# EAGLE schematic PocketBeagle (EAGLE 9.6.1)
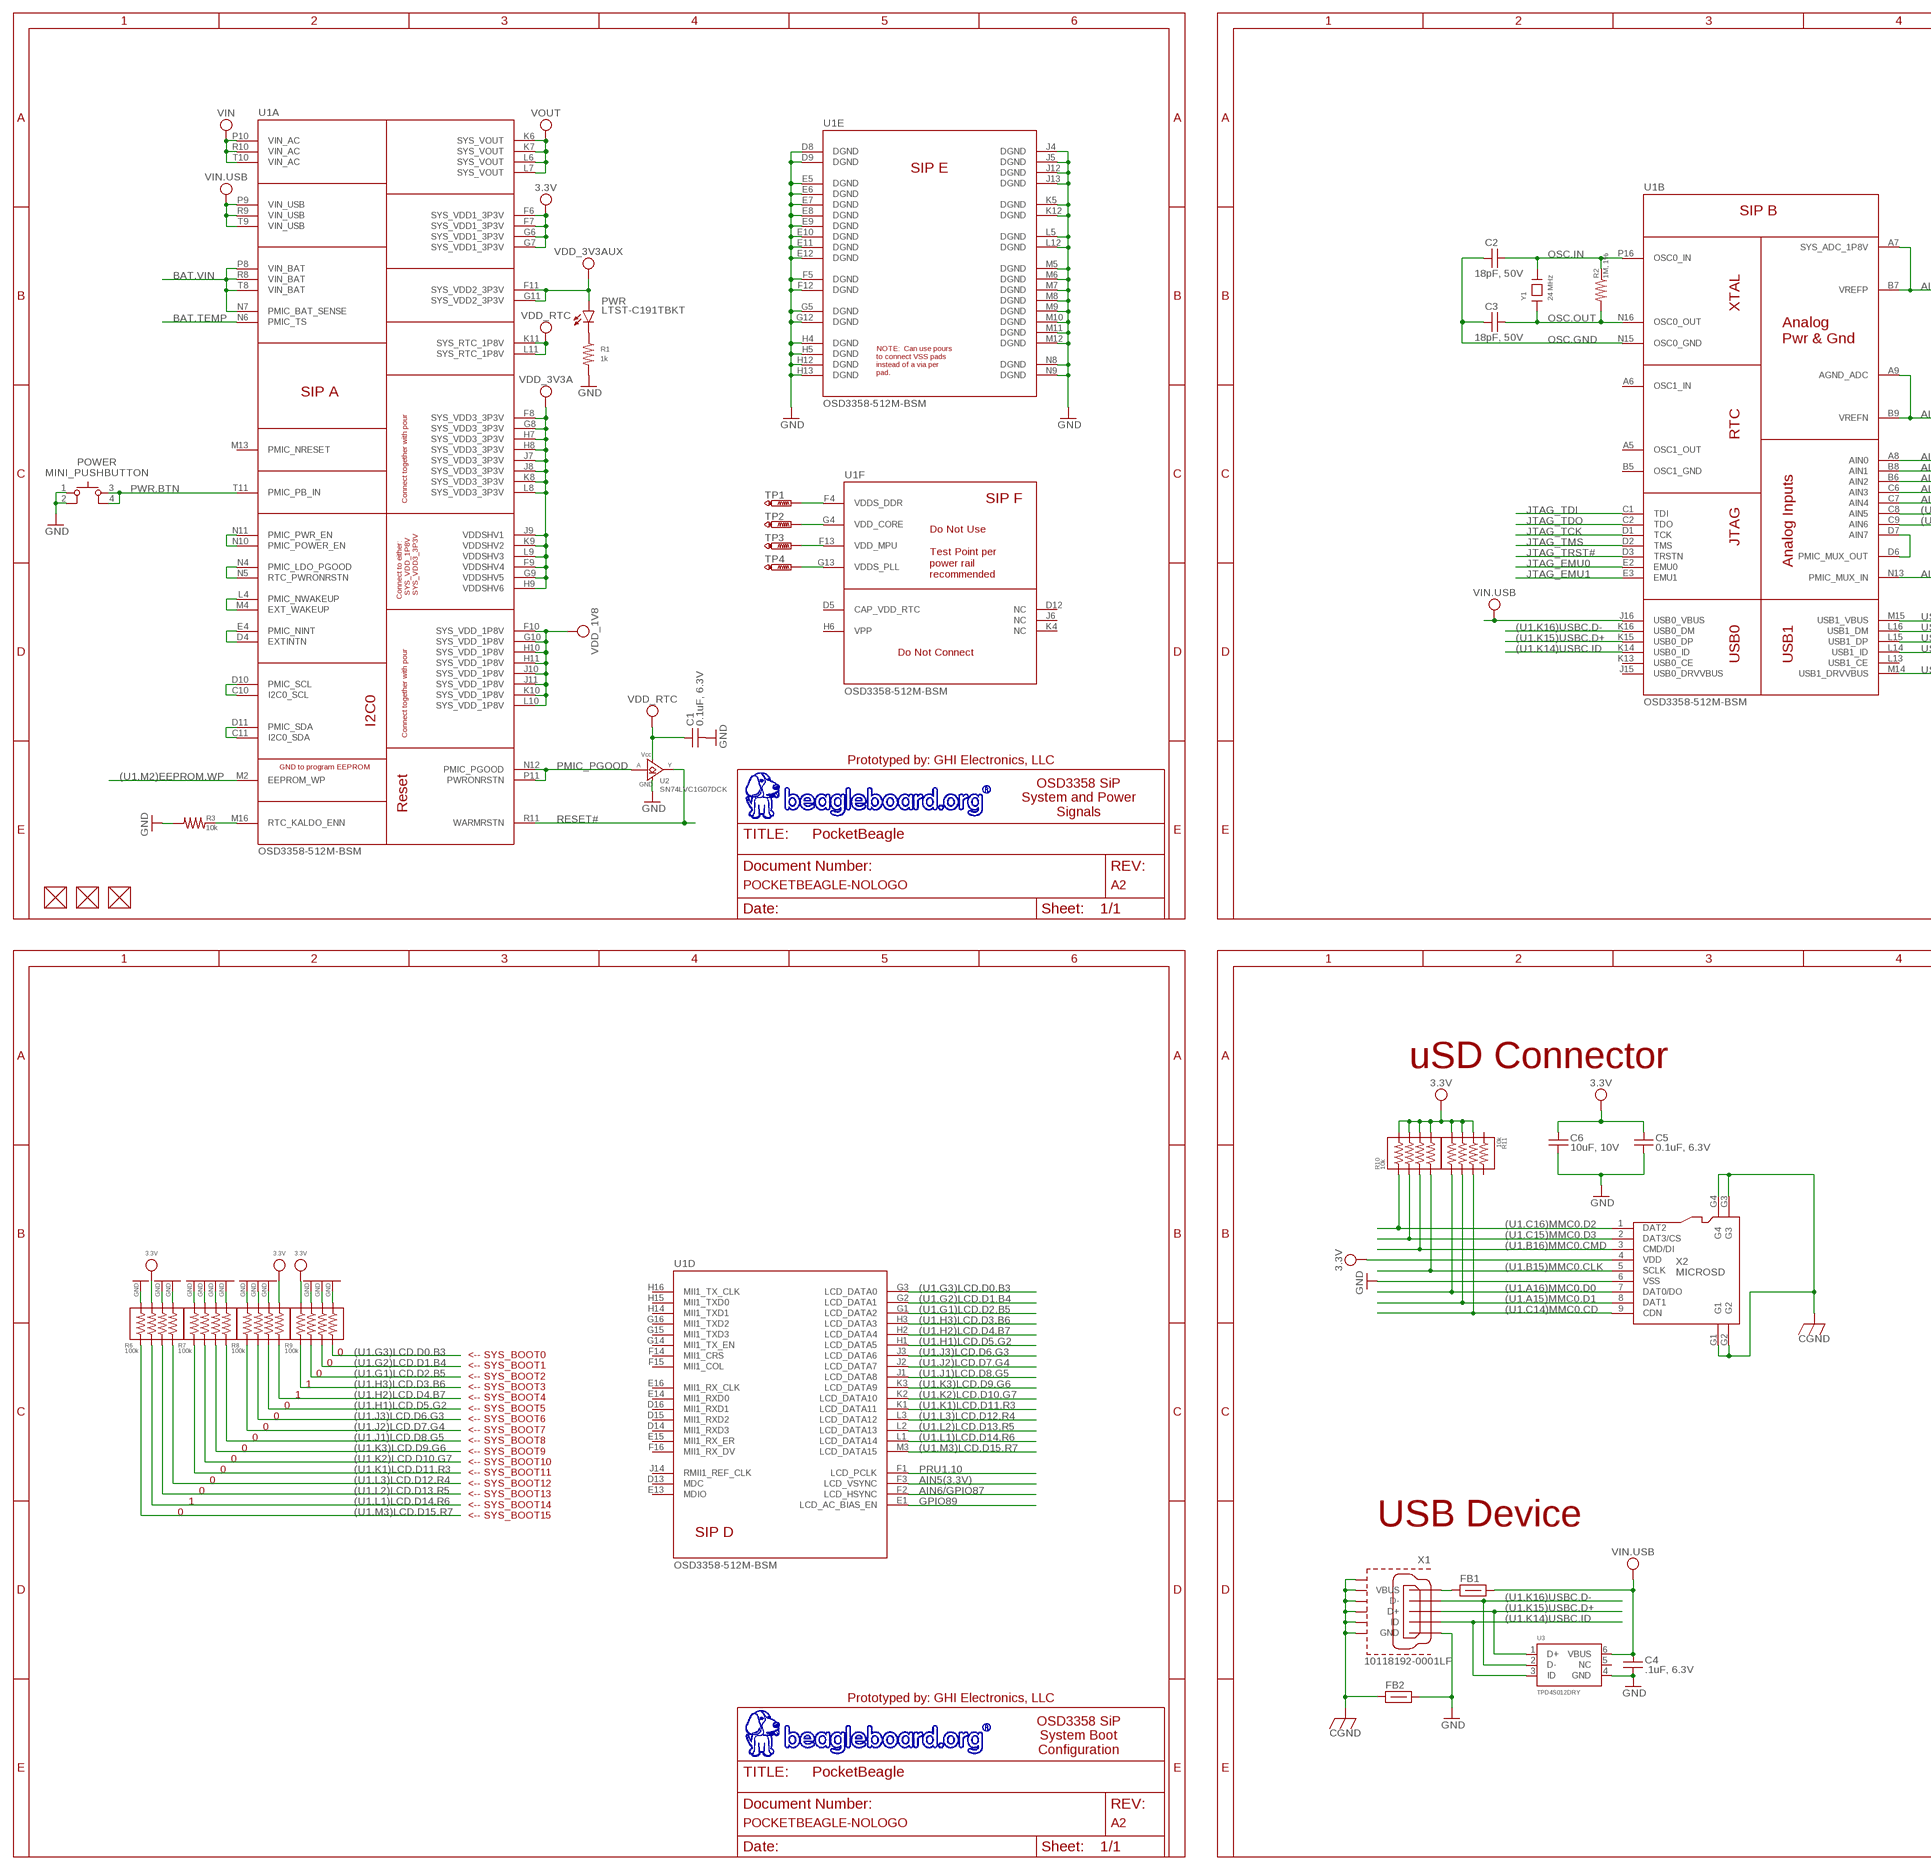
[diagram p0: schematic, sheet 1, part 1 of 2]
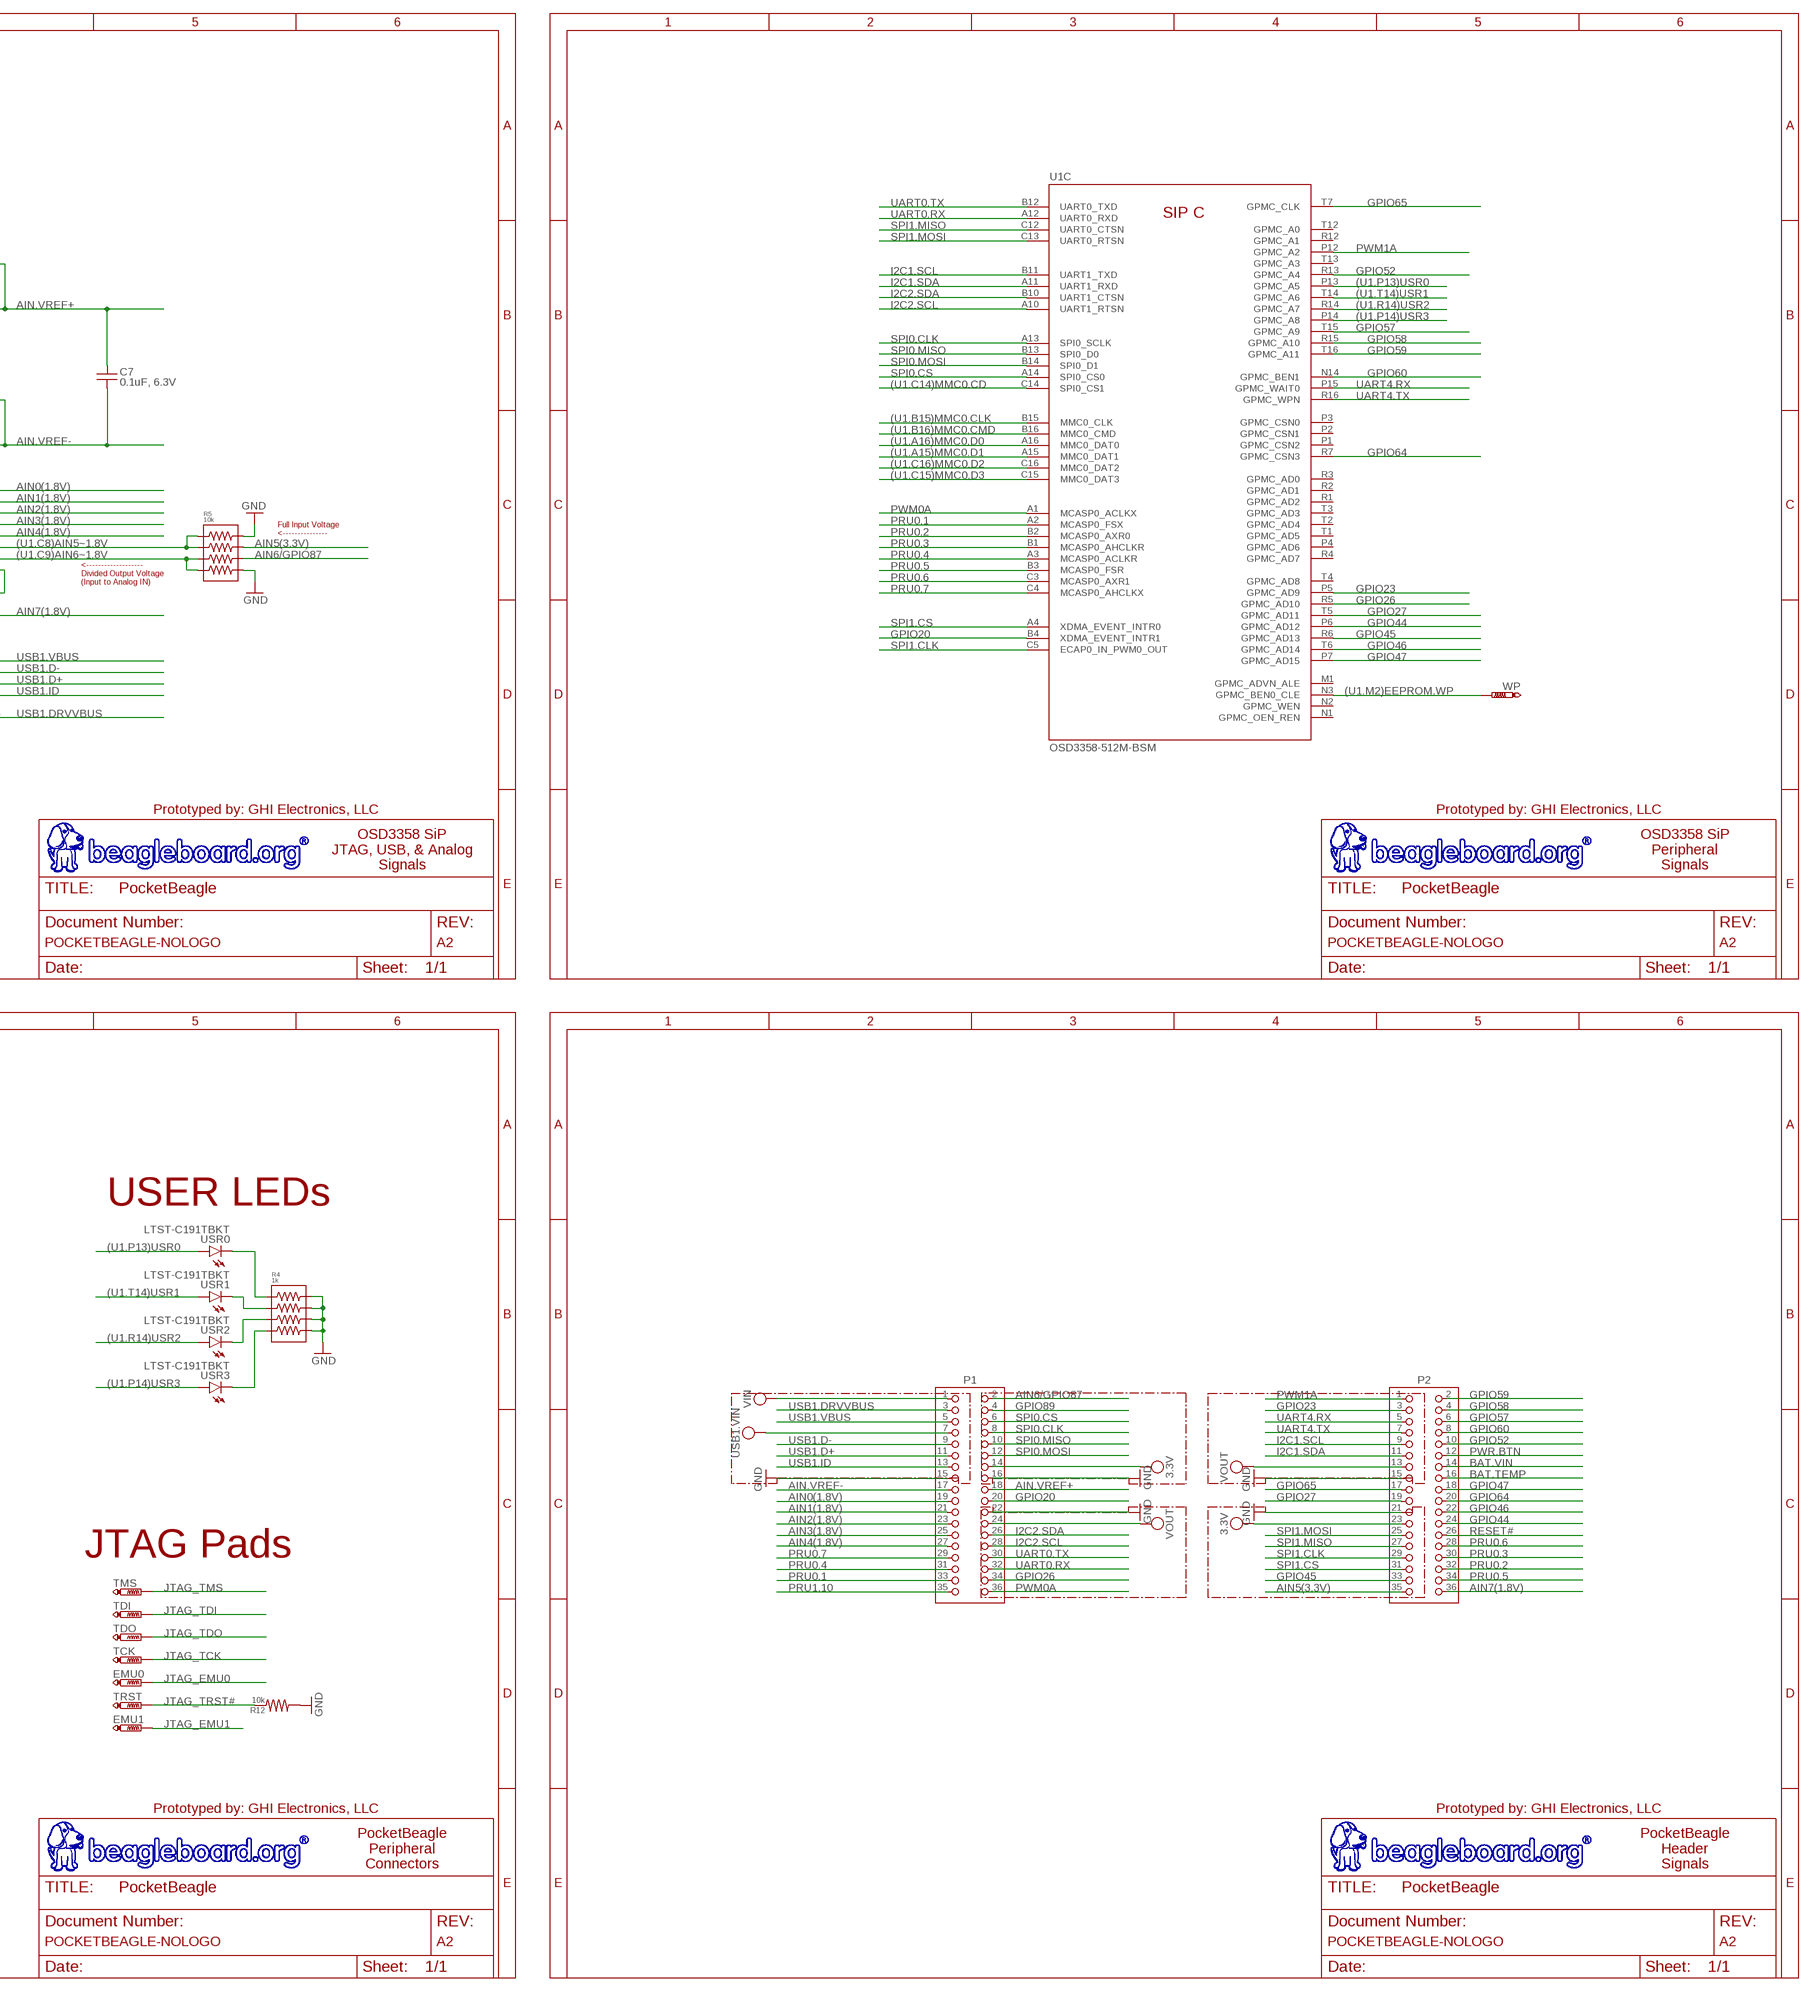
[diagram p1: schematic, sheet 1, part 2 of 2]

## Parts
C1  0.1uF, 6.3V  CAPACITOR-(INCH)-0402  [0402]
C2  18pF, 50V  CAPACITOR-(INCH)-0402  [0402]
C3  18pF, 50V  CAPACITOR-(INCH)-0402  [0402]
C4  .1uF, 6.3V  CAPACITOR-(INCH)-0402  [0402]
C5  0.1uF, 6.3V  CAPACITOR-(INCH)-0402  [0402]
C6  10uF, 10V  CAPACITOR-(INCH)-0603  [0603]
C7  0.1uF, 6.3V  CAPACITOR-(INCH)-0402  [0402]
EMU0  PTR1B1,27  [B1,27]
EMU1  PTR1B1,27  [B1,27]
FB1  FB-(INCH)-0603  [0603]
FB2  FB-(INCH)-0603  [0603]
FUD1  FIDUCIAL  [FIDUCIAL_40MIL]
FUD2  FIDUCIAL  [FIDUCIAL_40MIL]
FUD3  FIDUCIAL  [FIDUCIAL_40MIL]
P1  2X18-(INCH)-0.1-TH-(35MIL-DIA)-W/O-SILK  [TH-2X18-(35MIL-DIA)-W/O-SILK]
P2  2X18-(INCH)-0.1-TH-(35MIL-DIA)-W/O-SILK  [TH-2X18-(35MIL-DIA)-W/O-SILK]
POWER  MINI_PUSHBUTTON  [MINI_PUSHBUTTON]
PWR  LTST-C191TBKT  LED-(INCH)-0603  [0603-LED]
R1  1k  RESISTOR-(INCH)-0402  [0402]
R2  1M, 1%  RESISTOR-(INCH)-0402  [0402]
R3  10k  RESISTOR-(INCH)-0402  [0402]
R4  1k  RESISTOR.NETWORK-(4)  [RN0804]
R5  10k  RESISTOR.NETWORK-(4)  [RN0804]
R6  100k  RESISTOR.NETWORK-(4)  [RN0804]
R7  100k  RESISTOR.NETWORK-(4)  [RN0804]
R8  100k  RESISTOR.NETWORK-(4)  [RN0804]
R9  100k  RESISTOR.NETWORK-(4)  [RN0804]
R10  10k  RESISTOR.NETWORK-(4)  [RN0804]
R11  10k  RESISTOR.NETWORK-(4)  [RN0804]
R12  10k  RESISTOR-(INCH)-0402  [0402]
TCK  PTR1B1,27  [B1,27]
TDI  PTR1B1,27  [B1,27]
TDO  PTR1B1,27  [B1,27]
TMS  PTR1B1,27  [B1,27]
TP1  PTR1B1,27  [B1,27]
TP2  PTR1B1,27  [B1,27]
TP3  PTR1B1,27  [B1,27]
TP4  PTR1B1,27  [B1,27]
TRST  PTR1B1,27  [B1,27]
U1  OSD3358-512M-BSM  [OSD335X-BGA-256]
U2  SN74LVC1G07DCK  [SC70(TI-DCK)]
U3  TPD4S012DRY  TPD4S012DRYR  [SON-6(TI)-DRY]
USR0  LTST-C191TBKT  LED-(INCH)-0603  [0603-LED]
USR1  LTST-C191TBKT  LED-(INCH)-0603  [0603-LED]
USR2  LTST-C191TBKT  LED-(INCH)-0603  [0603-LED]
USR3  LTST-C191TBKT  LED-(INCH)-0603  [0603-LED]
WP  PTR1B1,27  [B1,27]
X1  10118192-0001LF  [10118192-0001LF(MICRO-USB-B-AMPHENOL-FCI)]
X2  MICROSD  [MICROSD]
Y1  24 MHz  CRYSTAL_5X3.2MM  [CRYSTAL_5X3.2MM]

## Nets
3.3V: C5.1 C6.1 P1.14 P2.23 R6.7 R8.5 R9.4 R10.5 R10.6 R10.7 R10.8 R11.2 R11.3 R11.4 U1.F6(A:SYS_VDD1_3P3V) U1.F7(A:SYS_VDD1_3P3V) U1.G6(A:SYS_VDD1_3P3V) U1.G7(A:SYS_VDD1_3P3V) X2.4(VDD)
(U1.A15)MMC0.D1: R11.6 U1.A15(C:MMC0_DAT1) X2.8(DAT1)
(U1.A16)MMC0.D0: R11.5 U1.A16(C:MMC0_DAT0) X2.7(DAT0/DO)
(U1.B15)MMC0.CLK: R10.4 U1.B15(C:MMC0_CLK) X2.5(SCLK)
(U1.B16)MMC0.CMD: R10.3 U1.B16(C:MMC0_CMD) X2.3(CMD/DI)
(U1.C8)AIN5~1.8V: R5.1 R5.2 U1.C8(B:AIN5)
(U1.C9)AIN6~1.8V: R5.3 R5.4 U1.C9(B:AIN6)
(U1.C14)MMC0.CD: R11.7 U1.C14(C:SPI0_CS1) X2.9(CDN)
(U1.C15)MMC0.D3: R10.2 U1.C15(C:MMC0_DAT3) X2.2(DAT3/CS)
(U1.C16)MMC0.D2: R10.1 U1.C16(C:MMC0_DAT2) X2.1(DAT2)
(U1.G1)LCD.D2.B5: R9.6 U1.G1(D:LCD_DATA2)
(U1.G2)LCD.D1.B4: R9.7 U1.G2(D:LCD_DATA1)
(U1.G3)LCD.D0.B3: R9.8 U1.G3(D:LCD_DATA0)
(U1.H1)LCD.D5.G2: R8.3 U1.H1(D:LCD_DATA5)
(U1.H2)LCD.D4.B7: R8.4 U1.H2(D:LCD_DATA4)
(U1.H3)LCD.D3.B6: R9.5 U1.H3(D:LCD_DATA3)
(U1.J1)LCD.D8.G5: R7.4 U1.J1(D:LCD_DATA8)
(U1.J2)LCD.D7.G4: R8.1 U1.J2(D:LCD_DATA7)
(U1.J3)LCD.D6.G3: R8.2 U1.J3(D:LCD_DATA6)
(U1.K1)LCD.D11.R3: R7.1 U1.K1(D:LCD_DATA11)
(U1.K2)LCD.D10.G7: R7.2 U1.K2(D:LCD_DATA10)
(U1.K3)LCD.D9.G6: R7.3 U1.K3(D:LCD_DATA9)
(U1.K14)USBC.ID: U1.K14(B:USB0_ID) U3.3(ID) X1.ID
(U1.K15)USBC.D+: U1.K15(B:USB0_DP) U3.1(D+) X1.D+
(U1.K16)USBC.D-: U1.K16(B:USB0_DM) U3.2(D-) X1.D-
(U1.L1)LCD.D14.R6: R6.2 U1.L1(D:LCD_DATA14)
(U1.L2)LCD.D13.R5: R6.3 U1.L2(D:LCD_DATA13)
(U1.L3)LCD.D12.R4: R6.4 U1.L3(D:LCD_DATA12)
(U1.M2)EEPROM.WP: U1.M2(A:EEPROM_WP) U1.N3(C:GPMC_BEN0_CLE) WP.TP
(U1.M3)LCD.D15.R7: R6.1 U1.M3(D:LCD_DATA15)
(U1.P13)USR0: U1.P13(C:GPMC_A5) USR0.A
(U1.P14)USR3: U1.P14(C:GPMC_A8) USR3.A
(U1.R14)USR2: U1.R14(C:GPMC_A7) USR2.A
(U1.T14)USR1: U1.T14(C:GPMC_A6) USR1.A
AIN0(1.8V): P1.19 U1.A8(B:AIN0)
AIN1(1.8V): P1.21 U1.B8(B:AIN1)
AIN2(1.8V): P1.23 U1.B6(B:AIN2)
AIN3(1.8V): P1.25 U1.C6(B:AIN3)
AIN4(1.8V): P1.27 U1.C7(B:AIN4)
AIN5(3.3V): P2.35 R5.7 U1.F3(D:LCD_VSYNC)
AIN6/GPIO87: P1.2 R5.6 U1.F2(D:LCD_HSYNC)
AIN7(1.8V): P2.36 U1.N13(B:PMIC_MUX_IN)
AIN.VREF+: C7.1 P1.18 U1.A7(B:SYS_ADC_1P8V) U1.B7(B:VREFP)
AIN.VREF-: C7.2 P1.17 U1.A9(B:AGND_ADC) U1.B9(B:VREFN)
BAT.TEMP: P2.16 U1.N6(A:PMIC_TS)
BAT.VIN: P2.14 U1.N7(A:PMIC_BAT_SENSE) U1.P8(A:VIN_BAT) U1.R8(A:VIN_BAT) U1.T8(A:VIN_BAT)
CGND: FB2.1 X1.CGND1(SGND1) X1.CGND2(SGND2) X1.CGND3(SGND3) X1.CGND4(SGND4) X1.CGND5(SGND5) X1.CGND6(SGND6) X2.G1 X2.G2 X2.G3 X2.G4
GND [power]: C1.2 C4.2 C5.2 C6.2 FB2.2 P1.15 P1.16 P1.22 P2.15 P2.21 POWER.1 POWER.2 R1.1 R3.1 R4.5 R4.6 R4.7 R4.8 R5.5 R5.8 R6.5 R6.6 R6.8 R7.5 R7.6 R7.7 R7.8 R8.6 R8.7 R8.8 R9.1 R9.2 R9.3 R12.1 U1.D8(E:DGND) U1.D9(E:DGND) U1.E5(E:DGND) U1.E6(E:DGND) U1.E7(E:DGND) U1.E8(E:DGND) U1.E9(E:DGND) U1.E10(E:DGND) U1.E11(E:DGND) U1.E12(E:DGND) U1.F5(E:DGND) U1.F12(E:DGND) U1.G5(E:DGND) U1.G12(E:DGND) U1.H4(E:DGND) U1.H5(E:DGND) U1.H12(E:DGND) U1.H13(E:DGND) U1.J4(E:DGND) U1.J5(E:DGND) U1.J12(E:DGND) U1.J13(E:DGND) U1.K5(E:DGND) U1.K12(E:DGND) U1.L5(E:DGND) U1.L12(E:DGND) U1.M5(E:DGND) U1.M6(E:DGND) U1.M7(E:DGND) U1.M8(E:DGND) U1.M9(E:DGND) U1.M10(E:DGND) U1.M11(E:DGND) U1.M12(E:DGND) U1.N8(E:DGND) U1.N9(E:DGND) U2.3(GND) U3.4(GND) X1.GND X2.6(VSS)
GPIO20: P1.20 U1.B4(C:XDMA_EVENT_INTR1)
GPIO23: P2.3 U1.P5(C:GPMC_AD9)
GPIO26: P1.34 U1.R5(C:GPMC_AD10)
GPIO27: P2.19 U1.T5(C:GPMC_AD11)
GPIO44: P2.24 U1.P6(C:GPMC_AD12)
GPIO45: P2.33 U1.R6(C:GPMC_AD13)
GPIO46: P2.22 U1.T6(C:GPMC_AD14)
GPIO47: P2.18 U1.P7(C:GPMC_AD15)
GPIO52: P2.10 U1.R13(C:GPMC_A4)
GPIO57: P2.6 U1.T15(C:GPMC_A9)
GPIO58: P2.4 U1.R15(C:GPMC_A10)
GPIO59: P2.2 U1.T16(C:GPMC_A11)
GPIO60: P2.8 U1.N14(C:GPMC_BEN1)
GPIO64: P2.20 U1.R7(C:GPMC_CSN3)
GPIO65: P2.17 U1.T7(C:GPMC_CLK)
GPIO89: P1.4 U1.E1(D:LCD_AC_BIAS_EN)
I2C1.SCL: P2.9 U1.B11(C:UART1_TXD)
I2C1.SDA: P2.11 U1.A11(C:UART1_RXD)
I2C2.SCL: P1.28 U1.A10(C:UART1_RTSN)
I2C2.SDA: P1.26 U1.B10(C:UART1_CTSN)
JTAG_EMU0: EMU0.TP U1.E2(B:EMU0)
JTAG_EMU1: EMU1.TP U1.E3(B:EMU1)
JTAG_TCK: TCK.TP U1.D1(B:TCK)
JTAG_TDI: TDI.TP U1.C1(B:TDI)
JTAG_TDO: TDO.TP U1.C2(B:TDO)
JTAG_TMS: TMS.TP U1.D2(B:TMS)
JTAG_TRST#: R12.2 TRST.TP U1.D3(B:TRSTN)
N$1: R4.3 USR2.K
N$2: R4.4 USR3.K
N$4: PWR.K R1.2
N$5: R4.2 USR1.K
N$6: R4.1 USR0.K
N$7: TP1.TP U1.F4(F:VDDS_DDR)
N$9: TP2.TP U1.G4(F:VDD_CORE)
N$10: TP3.TP U1.F13(F:VDD_MPU)
N$11: TP4.TP U1.G13(F:VDDS_PLL)
N$12: U1.D6(B:PMIC_MUX_OUT) U1.D7(B:AIN7)
N$22: R3.2 U1.M16(A:RTC_KALDO_ENN)
N$24: U1.N4(A:PMIC_LDO_PGOOD) U1.N5(A:RTC_PWRONRSTN)
N$25: U1.L4(A:PMIC_NWAKEUP) U1.M4(A:EXT_WAKEUP)
N$26: U1.D4(A:EXTINTN) U1.E4(A:PMIC_NINT)
N$27: U1.N10(A:PMIC_POWER_EN) U1.N11(A:PMIC_PWR_EN)
N$31: U1.C11(A:I2C0_SDA) U1.D11(A:PMIC_SDA)
N$32: U1.C10(A:I2C0_SCL) U1.D10(A:PMIC_SCL)
OSC.GND: C2.1 C3.1 U1.N15(B:OSC0_GND)
OSC.IN: C2.2 R2.2 U1.P16(B:OSC0_IN) Y1.2
OSC.OUT: C3.2 R2.1 U1.N16(B:OSC0_OUT) Y1.1
PMIC_PGOOD: U1.N12(A:PMIC_PGOOD) U1.P11(A:PWRONRSTN) U2.2(A)
PRU0.1: P1.33 U1.A2(C:MCASP0_FSX)
PRU0.2: P2.32 U1.B2(C:MCASP0_AXR0)
PRU0.3: P2.30 U1.B1(C:MCASP0_AHCLKR)
PRU0.4: P1.31 U1.A3(C:MCASP0_ACLKR)
PRU0.5: P2.34 U1.B3(C:MCASP0_FSR)
PRU0.6: P2.28 U1.C3(C:MCASP0_AXR1)
PRU0.7: P1.29 U1.C4(C:MCASP0_AHCLKX)
PRU1.10: P1.35 U1.F1(D:LCD_PCLK)
PWM0A: P1.36 U1.A1(C:MCASP0_ACLKX)
PWM1A: P2.1 U1.P12(C:GPMC_A2)
PWR.BTN: P2.12 POWER.3 POWER.4 U1.T11(A:PMIC_PB_IN)
RESET#: P2.26 U1.R11(A:WARMRSTN) U2.4(Y)
SPI0.CLK: P1.8 U1.A13(C:SPI0_SCLK)
SPI0.CS: P1.6 U1.A14(C:SPI0_CS0)
SPI0.MISO: P1.10 U1.B13(C:SPI0_D0)
SPI0.MOSI: P1.12 U1.B14(C:SPI0_D1)
SPI1.CLK: P2.29 U1.C5(C:ECAP0_IN_PWM0_OUT)
SPI1.CS: P2.31 U1.A4(C:XDMA_EVENT_INTR0)
SPI1.MISO: P2.27 U1.C12(C:UART0_CTSN)
SPI1.MOSI: P2.25 U1.C13(C:UART0_RTSN)
UART0.RX: P1.32 U1.A12(C:UART0_RXD)
UART0.TX: P1.30 U1.B12(C:UART0_TXD)
UART4.RX: P2.5 U1.P15(C:GPMC_WAIT0)
UART4.TX: P2.7 U1.R16(C:GPMC_WPN)
USB1.D+: P1.11 U1.L15(B:USB1_DP)
USB1.D-: P1.9 U1.L16(B:USB1_DM)
USB1.DRVVBUS: P1.3 U1.M14(B:USB1_DRVVBUS)
USB1.ID: P1.13 U1.L14(B:USB1_ID)
USB1.VBUS: P1.5 U1.M15(B:USB1_VBUS)
VBUS.RAW: FB1.1 X1.VBUS
VDD_1V8: U1.F10(A:SYS_VDD_1P8V) U1.G10(A:SYS_VDD_1P8V) U1.H10(A:SYS_VDD_1P8V) U1.H11(A:SYS_VDD_1P8V) U1.J10(A:SYS_VDD_1P8V) U1.J11(A:SYS_VDD_1P8V) U1.K10(A:SYS_VDD_1P8V) U1.L10(A:SYS_VDD_1P8V)
VDD_3V3A: U1.F8(A:SYS_VDD3_3P3V) U1.F9(A:VDDSHV4) U1.G8(A:SYS_VDD3_3P3V) U1.G9(A:VDDSHV5) U1.H7(A:SYS_VDD3_3P3V) U1.H8(A:SYS_VDD3_3P3V) U1.H9(A:VDDSHV6) U1.J7(A:SYS_VDD3_3P3V) U1.J8(A:SYS_VDD3_3P3V) U1.J9(A:VDDSHV1) U1.K8(A:SYS_VDD3_3P3V) U1.K9(A:VDDSHV2) U1.L8(A:SYS_VDD3_3P3V) U1.L9(A:VDDSHV3)
VDD_3V3AUX: PWR.A U1.F11(A:SYS_VDD2_3P3V) U1.G11(A:SYS_VDD2_3P3V)
VDD_RTC: C1.1 U1.K11(A:SYS_RTC_1P8V) U1.L11(A:SYS_RTC_1P8V) U2.5(VCC)
VIN: P1.1 U1.P10(A:VIN_AC) U1.R10(A:VIN_AC) U1.T10(A:VIN_AC)
VIN.USB: C4.1 FB1.2 P1.7 U1.J16(B:USB0_VBUS) U1.P9(A:VIN_USB) U1.R9(A:VIN_USB) U1.T9(A:VIN_USB) U3.6(VBUS) ; supply symbol labelled USB1.VIN
VOUT: P1.24 P2.13 U1.K6(A:SYS_VOUT) U1.K7(A:SYS_VOUT) U1.L6(A:SYS_VOUT) U1.L7(A:SYS_VOUT)
Unconnected: FUD1.P$1 FUD2.P$1 FUD3.P$1 R11.1 R11.8 U1.A5(B:OSC1_OUT) U1.A6(B:OSC1_IN) U1.B5(B:OSC1_GND) U1.D5(F:CAP_VDD_RTC) U1.D12(F:NC) U1.D13(D:MDC) U1.D14(D:MII1_RXD3) U1.D15(D:MII1_RXD2) U1.D16(D:MII1_RXD1) U1.E13(D:MDIO) U1.E14(D:MII1_RXD0) U1.E15(D:MII1_RX_ER) U1.E16(D:MII1_RX_CLK) U1.F14(D:MII1_CRS) U1.F15(D:MII1_COL) U1.F16(D:MII1_RX_DV) U1.G14(D:MII1_TX_EN) U1.G15(D:MII1_TXD3) U1.G16(D:MII1_TXD2) U1.H6(F:VPP) U1.H14(D:MII1_TXD1) U1.H15(D:MII1_TXD0) U1.H16(D:MII1_TX_CLK) U1.J6(F:NC) U1.J14(D:RMII1_REF_CLK) U1.J15(B:USB0_DRVVBUS) U1.K4(F:NC) U1.K13(B:USB0_CE) U1.L13(B:USB1_CE) U1.M1(C:GPMC_ADVN_ALE) U1.M13(A:PMIC_NRESET) U1.N1(C:GPMC_OEN_REN) U1.N2(C:GPMC_WEN) U1.P1(C:GPMC_CSN2) U1.P2(C:GPMC_CSN1) U1.P3(C:GPMC_CSN0) U1.P4(C:GPMC_AD6) U1.R1(C:GPMC_AD2) U1.R2(C:GPMC_AD1) U1.R3(C:GPMC_AD0) U1.R4(C:GPMC_AD7) U1.R12(C:GPMC_A1) U1.T1(C:GPMC_AD5) U1.T2(C:GPMC_AD4) U1.T3(C:GPMC_AD3) U1.T4(C:GPMC_AD8) U1.T12(C:GPMC_A0) U1.T13(C:GPMC_A3) U3.5(NC)

## Notes on the sheet
- Full Input Voltage
  <---------------
- <-------------------
  Divided Output Voltage
  (Input to Analog IN)
- Prototyped by: GHI Electronics, LLC | Prototyped by: GHI Electronics, LLC | Prototyped by: GHI Electronics, LLC
- OSD3358 SiP
  System and Power
  Signals
- OSD3358 SiP
  JTAG, USB, & Analog
  Signals
- OSD3358 SiP
  Peripheral
  Signals
- POCKETBEAGLE-NOLOGO | A2 | POCKETBEAGLE-NOLOGO | A2 | POCKETBEAGLE-NOLOGO | A2
- uSD Connector
- USER LEDs
- 0
- 0
- 0
- 1
- 1
- 0
- 0
- 0
- 0
- 0
- 0 | JTAG Pads
- 0
- 0
- 0
- 1
- 0
- <-- SYS_BOOT0
  <-- SYS_BOOT1
  <-- SYS_BOOT2
  <-- SYS_BOOT3
  <-- SYS_BOOT4
  <-- SYS_BOOT5
  <-- SYS_BOOT6
  <-- SYS_BOOT7
  <-- SYS_BOOT8
  <-- SYS_BOOT9
  <-- SYS_BOOT10
  <-- SYS_BOOT11
  <-- SYS_BOOT12
  <-- SYS_BOOT13
  <-- SYS_BOOT14
  <-- SYS_BOOT15
- USB Device
- Prototyped by: GHI Electronics, LLC | Prototyped by: GHI Electronics, LLC | Prototyped by: GHI Electronics, LLC
- OSD3358 SiP
  System Boot
  Configuration
- PocketBeagle
  Peripheral
  Connectors
- PocketBeagle
  Header
  Signals
- POCKETBEAGLE-NOLOGO | A2 | POCKETBEAGLE-NOLOGO | A2 | POCKETBEAGLE-NOLOGO | A2

## Library data of the parts
C1-C7 = GHI-BasicComponents:CAPACITOR-(INCH)-: Basic SMD ceramic capacitors
EMU0 EMU1 TCK TDI TDO TMS TP1-TP4 TRST WP = testpad:PTR1: TEST PIN
FB1 FB2 = GHI-BasicComponents:FB-(INCH)-
FUD1-FUD3 = GHI:FIDUCIAL
P1 P2 = GHI-Headers:2X18-(INCH)-0.1-
POWER = GHI2:MINI_PUSHBUTTON
PWR USR0 USR1-USR3 = GHI-BasicComponents:LED-(INCH)-: Basic SMD LEDs
R1-R3 R12 = GHI-BasicComponents:RESISTOR-(INCH)-: Basic SMD Resistors
R4-R11 = GHI-BasicComponents:RESISTOR.NETWORK-(4)
U1 = GHI-SoMs-Processors:OSD3358-512M-BSM: Octavo Systems LLC OSD335x Family SiP: 21mm x 21mm, 1.27mm pitch 256 pin BGA contains AM3358, 512MB DDR3, TPS65217, TL5209, EEPROM and passives. Commerical Temperature: 0C to 85C.
U2 = GHI-IC:SN74LVC1G07DCK
U3 = GHI-IC:TPD4S012DRYR
X1 = GHI-Connectors:10118192-0001LF: Amphenol FCI Micro USB Type B Complete Surface Mount (SMT) no guide holes
X2 = microSD:MICROSD
Y1 = GHI2:CRYSTAL_5X3.2MM